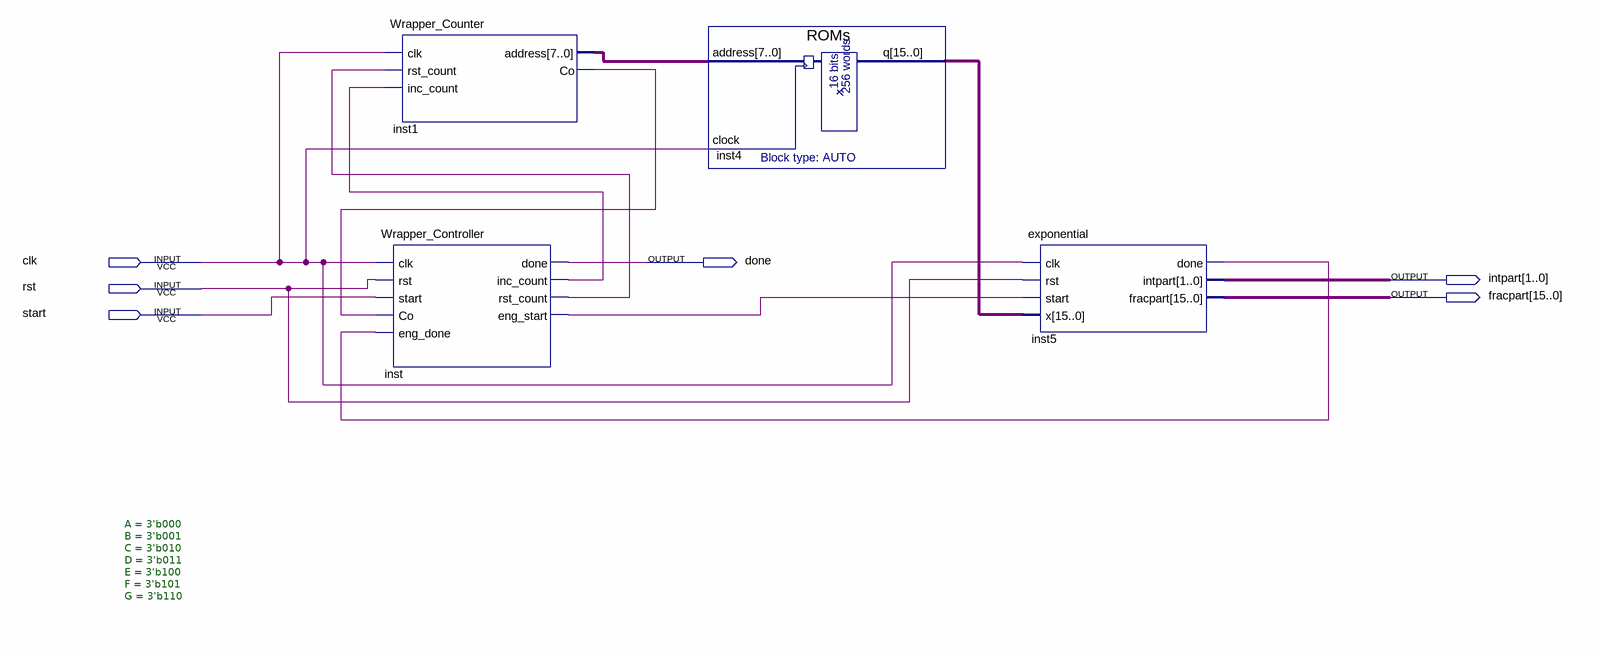
[diagram p0: schematic sheet]
// Quartus schematic Wrapper.bdf as structural Verilog: 4 symbols, 6 pins
module Wrapper (
  input  clk,
  input  rst,
  input  start,
  output done,
  output [1:0] intpart,
  output [15:0] fracpart
);

  wire inst1_co, inst5_done, inst_eng_start, inst_inc_count, inst_rst_count;
  wire [7:0] inst1_address;
  wire [15:0] inst4_q;

  Wrapper_Counter inst1 (
    .clk(clk), .rst_count(inst_rst_count), .inc_count(inst_inc_count), .address(inst1_address), .Co(inst1_co));
  Wrapper_Controller #(.A(3'b000), .B(3'b001), .C(3'b010), .D(3'b011), .E(3'b100), .F(3'b101), .G(3'b110)) inst (
    .clk(clk), .rst(rst), .start(start), .Co(inst1_co), .eng_done(inst5_done), .done(done),
    .inc_count(inst_inc_count), .rst_count(inst_rst_count), .eng_start(inst_eng_start));
  ROMs inst4 (.address(inst1_address), .clock(clk), .q(inst4_q));
  exponential inst5 (
    .clk(clk), .rst(rst), .start(inst_eng_start), .x(inst4_q), .done(inst5_done), .intpart(intpart),
    .fracpart(fracpart));
endmodule
